# Altium project MSXV_PCS_Rev_1.2.PrjPcb
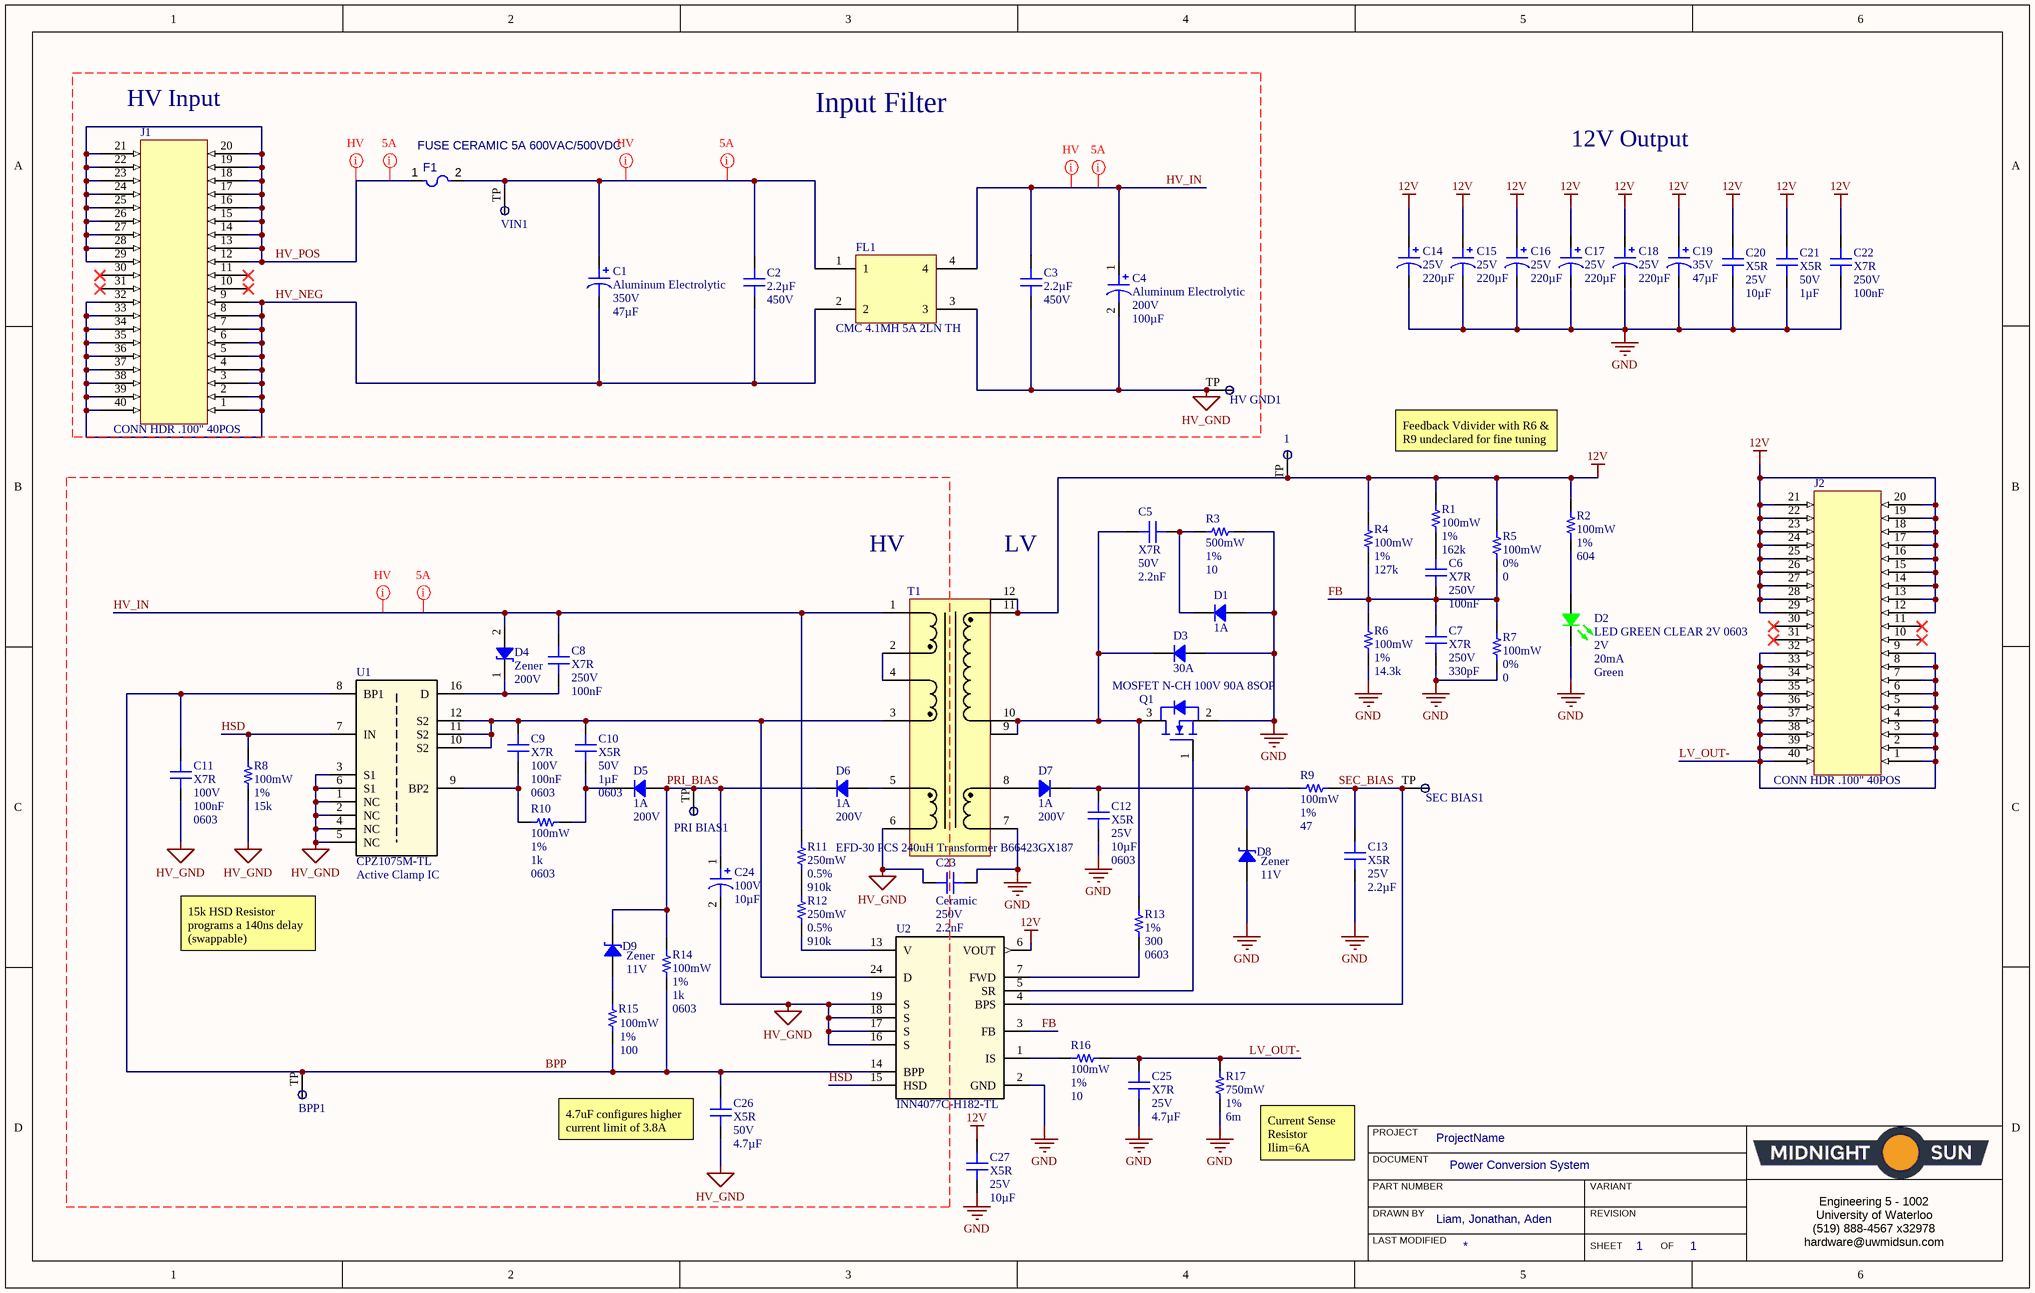
[diagram p0: PCS Schematic.SchDoc]
1 sheet, 67 parts. Net scope: global (net labels, ports and power ports of the same name join across sheets).
Board file: PCS - PCB.PcbDoc

## Sheet PCS Schematic.SchDoc: Power Conversion System
size B; Author: Liam Sky, Jonathan Xie, Aden Chu; Engineer: Liam Sky, Jonathan Xie, Aden Chu; Organization: Midnight Sun Solar Rayce Car Team; Address1: University of Waterloo; Address2: 200 University Ave W; Address3: Waterloo, ON, Canada; Address4: N2L 3E9; Revision: 1,0; SheetNumber: 1; SheetTotal: 1; Website: www.uwmidsun.com; ProjectAuthor: Liam, Jonathan, Aden; ProjectName: ProjectName

### Parts
1  Test Point SMD  [Test Point]  (value not drawn)  (no BOM)
BPP1  Test Point SMD  [Test Point]  (value not drawn)  (no BOM)
C1  Dielectric Code: Aluminum Electrolytic  Voltage Rating: 350V  Capacitance: 47µF  [Radial e7.5mm h27]  (hidden comment: CAP ALUM 47UF 20% 350V RADIAL TH)
C2  Capacitance: 2.2µF  Voltage Rating: 450V  [CAP FILM 2.2UF 5% 450VDC RADIAL-Footprint-1]  (hidden comment: CAP FILM 2.2UF 5% 450VDC RADIAL)
C3  Capacitance: 2.2µF  Voltage Rating: 450V  [CAP FILM 2.2UF 5% 450VDC RADIAL-Footprint-1]  (hidden comment: CAP FILM 2.2UF 5% 450VDC RADIAL)
C4  Dielectric Code: Aluminum Electrolytic  Voltage Rating: 200V  Capacitance: 100µF  [Radial e7.5mm h27]  (hidden comment: CAP ALUM 100UF 20% 200V RADIAL)
C5  Dielectric Code: X7R  Voltage Rating: 50V  Capacitance: 2.2nF  [CAP 0603_1608]  (hidden comment: CAP CER 2.2NF 50V 10% X7R 0603)
C6  Dielectric Code: X7R  Voltage Rating: 250V  Capacitance: 100nF  [FER 0805_2012]  (hidden comment: CAP CER 0.1UF 250V X7R 0805)
C7  Dielectric Code: X7R  Voltage Rating: 250V  Capacitance: 330pF  [CAP 0603_1608]  (hidden comment: CAP CER 330PF 250V X7R 0603)
C8  Dielectric Code: X7R  Voltage Rating: 250V  Capacitance: 100nF  [CAP 1206_3216]  (hidden comment: CAP CER 0.1UF 250V X7R 1206)
C9  Dielectric Code: X7R  Voltage Rating: 100V  Capacitance: 100nF  Case/Package: 0603  [CAP 0603_1608]  (hidden comment: CAP CER 0.1UF 100V 10% X7R 0603)
C10  Dielectric Code: X5R  Voltage Rating: 50V  Capacitance: 1µF  Case/Package: 0603  [CAP 0603_1608]  (hidden comment: CAP CER 1UF 50V X5R 0603)
C11  Dielectric Code: X7R  Voltage Rating: 100V  Capacitance: 100nF  Case/Package: 0603  [CAP 0603_1608]  (hidden comment: CAP CER 0.1UF 100V 10% X7R 0603)
C12  Dielectric Code: X5R  Voltage Rating: 25V  Capacitance: 10µF  Case/Package: 0603  [CAP 0603_1608]  (hidden comment: CAP CER 10UF 25V 20% X5R 0603)
C13  Dielectric Code: X5R  Voltage Rating: 25V  Capacitance: 2.2µF  [CAP 0603_1608]  (hidden comment: CAP CER 2.2UF 25V 10% X5R 0603)
C14  Voltage Rating: 25V  Capacitance: 220µF  [CAP ALUM 220UF 20% 25V RADIAL-Footprint-1]  (hidden comment: CAP ALUM 220UF 20% 25V RADIAL)
C15  Voltage Rating: 25V  Capacitance: 220µF  [CAP ALUM 220UF 20% 25V RADIAL-Footprint-1]  (hidden comment: CAP ALUM 220UF 20% 25V RADIAL)
C16  Voltage Rating: 25V  Capacitance: 220µF  [CAP ALUM 220UF 20% 25V RADIAL-Footprint-1]  (hidden comment: CAP ALUM 220UF 20% 25V RADIAL)
C17  Voltage Rating: 25V  Capacitance: 220µF  [CAP ALUM 220UF 20% 25V RADIAL-Footprint-1]  (hidden comment: CAP ALUM 220UF 20% 25V RADIAL)
C18  Voltage Rating: 25V  Capacitance: 220µF  [CAP ALUM 220UF 20% 25V RADIAL-Footprint-1]  (hidden comment: CAP ALUM 220UF 20% 25V RADIAL)
C19  Voltage Rating: 35V  Capacitance: 47µF  [CAP ALUM 6.3MM RADIAL SMD]  (hidden comment: CAP ALUM 47UF 20% 35V SMD)
C20  Dielectric Code: X5R  Voltage Rating: 25V  Capacitance: 10µF  [CAP 0603_1608]  (hidden comment: CAP CER 10UF 25V 20% X5R 0603)
C21  Dielectric Code: X5R  Voltage Rating: 50V  Capacitance: 1µF  [CAP 0603_1608]  (hidden comment: CAP CER 1UF 50V X5R 0603)
C22  Dielectric Code: X7R  Voltage Rating: 250V  Capacitance: 100nF  [FER 0805_2012]  (hidden comment: CAP CER 0.1UF 250V X7R 0805)
C23  Dielectric Code: Ceramic  Voltage Rating: 250V  Capacitance: 2.2nF  [FP-DE1_D9_T4_F10_d0_6-0_0-MFG]  (hidden comment: CAP CER 2200PF 250V RADIAL)
C24  Voltage Rating: 100V  Capacitance: 10µF  [FP-RAD-TH-D_5_0_5-L_11_1-MFG]  (hidden comment: CAP ALUM 10UF 20% 100V RADIAL TH)
C25  Dielectric Code: X7R  Voltage Rating: 25V  Capacitance: 4.7µF  [CAP 0603_1608]  (hidden comment: CAP CER 4.7UF 25V 10% X5R 0603)
C26  Dielectric Code: X5R  Voltage Rating: 50V  Capacitance: 4.7µF  [CAP 0805_2012]  (hidden comment: CAP CER 4.7UF 50V 10% X5R 0805)
C27  Dielectric Code: X5R  Voltage Rating: 25V  Capacitance: 10µF  [CAP 0603_1608]  (hidden comment: CAP CER 10UF 25V 20% X5R 0603)
D1  Forward Current: 1A  [DO 214AC SMA]  (hidden comment: ULTRA FAST RECOVERY RECTIFIERS 2)
D2  LED GREEN CLEAR 2V 0603  Forward Voltage: 2V  Forward Current: 20mA  Colour: Green  [LED 0603_1608]
D3  Forward Current: 30A  [New footprint 1]  (hidden comment: DIODE SCHOTTKY 170V 30A PWRFLAT)
D4  Type: Zener  Reverse Blocking Voltage: 200V  [DIODE ZENER 200V 800MW DO219AB-Footprint-1]  (hidden comment: DIODE ZENER 200V 800MW DO219AB)
D5  Forward Current: 1A  Reverse Blocking Voltage: 200V  [DO 214AC SMA]  (hidden comment: ULTRA FAST RECOVERY RECTIFIERS 2)
D6  Forward Current: 1A  Reverse Blocking Voltage: 200V  [DO 214AC SMA]  (hidden comment: ULTRA FAST RECOVERY RECTIFIERS 2)
D7  Forward Current: 1A  Reverse Blocking Voltage: 200V  [DO 214AC SMA]  (hidden comment: ULTRA FAST RECOVERY RECTIFIERS 2)
D8  Type: Zener  Reverse Blocking Voltage: 11V  [SOD 323]  (hidden comment: DIODE, ZENER, 0.20W, 11.0V, 2%,)
D9  Type: Zener  Reverse Blocking Voltage: 11V  [SOD 323]  (hidden comment: DIODE, ZENER, 0.20W, 11.0V, 2%,)
F1  FUSE CERAMIC 5A 600VAC/500VDC  [0ADKC5000-BE-Footprint-1]
FL1  CMC 4.1MH 5A 2LN TH  [New footprint 1]
HV_GND1  Test Point SMD  [Test Point]  (value not drawn)  (no BOM)
J1  CONN HDR .100" 40POS  [CONN HDR .100" 40POS-Footprint-1]
J2  CONN HDR .100" 40POS  [CONN HDR .100" 40POS-Footprint-1]
PRI_BIAS1  Test Point SMD  [Test Point]  (value not drawn)  (no BOM)
Q1  MOSFET N-CH 100V 90A 8SOP  [TPH3R70APL,L1Q]
R1  Power Rating: 100mW  Tolerance: 1%  Resistance: 162k  [RES 0603_1608]  (hidden comment: RES 162K OHM 1% 1/10W 0603)
R2  Power Rating: 100mW  Tolerance: 1%  Resistance: 604  [RES 0603_1608]  (hidden comment: RES 604 OHM 1% 1/10W 0603)
R3  Power Rating: 500mW  Tolerance: 1%  Resistance: 10  [CAP 0805_2012]  (hidden comment: RES 10 OHM 1% 1/2W 0805)
R4  Power Rating: 100mW  Tolerance: 1%  Resistance: 127k  [RES 0603_1608]  (hidden comment: RES 127K OHM 1% 1/10W 0603)
R5  Power Rating: 100mW  Tolerance: 0%  Resistance: 0  [RES 0603_1608]  (hidden comment: RES 0 OHM JUMPER 1/10W 0603)
R6  Power Rating: 100mW  Tolerance: 1%  Resistance: 14.3k  [RES 0603_1608]  (hidden comment: RES 14.3K OHM 1% 1/10W 0603)
R7  Power Rating: 100mW  Tolerance: 0%  Resistance: 0  [RES 0603_1608]  (hidden comment: RES 0 OHM JUMPER 1/10W 0603)
R8  Power Rating: 100mW  Tolerance: 1%  Resistance: 15k  [RES 0603_1608]  (hidden comment: RES 15K OHM 1% 1/10W 0603)
R9  Power Rating: 100mW  Tolerance: 1%  Resistance: 47  [RES 0603_1608]  (hidden comment: RES 47 OHM 1% 1/10W 0603)
R10  Power Rating: 100mW  Tolerance: 1%  Resistance: 1k  Case/Package: 0603  [RES 0603_1608]  (hidden comment: RES 1K OHM 1% 1/10W 0603)
R11  Power Rating: 250mW  Tolerance: 0.5%  Resistance: 910k  [RES 0805_2012]  (hidden comment: RES SMD 910K OHM 0.5% 1/4W 0805)
R12  Power Rating: 250mW  Tolerance: 0.5%  Resistance: 910k  [RES 0805_2012]  (hidden comment: RES SMD 910K OHM 0.5% 1/4W 0805)
R13  Tolerance: 1%  Resistance: 300  Case/Package: 0603  [RES 0603_1608]  (hidden comment: RES 300 OHM 1% 1/10W 0603)
R14  Power Rating: 100mW  Tolerance: 1%  Resistance: 1k  Case/Package: 0603  [RES 0603_1608]  (hidden comment: RES 1K OHM 1% 1/10W 0603)
R15  Power Rating: 100mW  Tolerance: 1%  Resistance: 100  [RES 0603_1608]  (hidden comment: RES 100 OHM 1% 1/10W 0603)
R16  Power Rating: 100mW  Tolerance: 1%  Resistance: 10  [RES 0603_1608]  (hidden comment: RES 10 OHM 1% 1/10W 0603)
R17  Power Rating: 750mW  Tolerance: 1%  Resistance: 6m  [RES 0805_2012]  (hidden comment: RES 0.006 OHM 1% 3/4W 0805)
SEC_BIAS1  Test Point SMD  [Test Point]  (value not drawn)  (no BOM)
T1  EFD-30 PCS 240uH Transformer B66423GX187  [EFD-30 PCS 240uH Transformer B66423GX187-Footprint-1]
U1  CPZ1075M-TL  [CPZ1076M-Footprint-1]
U2  INN4077C-H182-TL  [INN4074C-H185-Footprint-1]
VIN1  Test Point SMD  [Test Point]  (value not drawn)  (no BOM)

### Nets
12V: 1.TP C14.1 C15.1 C16.1 C17.1 C18.1 C19.1 C20.2 C21.2 C22.2 C27.2 J2.12 J2.13 J2.14 J2.15 J2.16 J2.17 J2.18 J2.19 J2.20 J2.21 J2.22 J2.23 J2.24 J2.25 J2.26 J2.27 J2.28 J2.29 R1.2 R2.2 R4.2 R5.1 T1.11(Sec+) T1.12(Sec+) U2.6(VOUT)
GND: C7.2 C12.2 C13.2 C14.2 C15.2 C16.2 C17.2 C18.2 C19.2 C20.1 C21.1 C22.1 C23.2 C25.1 C27.1 D1.2 D2.1 D3.1(A) D8.2 Q1.2(S) R3.2 R6.1 R7.1 R17.2 T1.7(Bias2-) U2.2(GND)
HV_GND: C3.1 C4.2 C11.1 C23.1 C24.2 C26.1 FL1.3 HV_GND1.TP R8.1 T1.6(Bias1-) U1.1(NC) U1.2(NC) U1.3(S1) U1.4(NC) U1.5(NC) U1.6(S1) U2.16(S) U2.17(S) U2.18(S) U2.19(S)
BPP: BPP1.TP C11.2 C26.2 R14.1 R15.1 U1.8(BP1) U2.14(BPP)
FB: C6.1 C7.1 R4.1 R5.2 R6.2 R7.2 U2.3(FB)
HSD: R8.2 U1.7(IN) U2.15(HSD)
HV_IN: C3.2 C4.1 C8.2 D4.2 FL1.4 R11.1 T1.1(Pri+)
HV_NEG: C1.2 C2.1 FL1.2 J1.1 J1.2 J1.3 J1.4 J1.5 J1.6 J1.7 J1.8 J1.9 J1.32 J1.33 J1.34 J1.35 J1.36 J1.37 J1.38 J1.39 J1.40
HV_POS: F1.1 J1.12 J1.13 J1.14 J1.15 J1.16 J1.17 J1.18 J1.19 J1.20 J1.21 J1.22 J1.23 J1.24 J1.25 J1.26 J1.27 J1.28 J1.29
LV_OUT-: C25.2 J2.1 J2.2 J2.3 J2.4 J2.5 J2.6 J2.7 J2.8 J2.9 J2.32 J2.33 J2.34 J2.35 J2.36 J2.37 J2.38 J2.39 J2.40 R16.1 R17.1
PRI_BIAS: C24.1 D5.2 D6.1 D9.1 PRI_BIAS1.TP R14.2
SEC_BIAS: C13.1 R9.1 SEC_BIAS1.TP U2.4(BPS)
NetC1_1: C1.1 C2.2 F1.2 FL1.1 VIN1.TP
NetC5_1: C5.1 D3.2(K) Q1.3(D) R13.2 T1.9(Sec-) T1.10(Sec-)
NetC5_2: C5.2 D1.1 R3.1
NetC6_2: C6.2 R1.1
NetC8_1: C8.1 D4.1 U1.16(D)
NetC9_1: C9.1 R10.2 U1.9(BP2)
NetC9_2: C9.2 C10.2 T1.3(Pri-) U1.10(S2) U1.11(S2) U1.12(S2) U2.24(D)
NetC10_1: C10.1 D5.1 R10.1
NetC12_1: C12.1 D7.1 D8.1 R9.2
NetD2_2: D2.2 R2.1
NetD6_2: D6.2 T1.5(Bias1+)
NetD7_2: D7.2 T1.8(Bias2+)
NetD9_2: D9.2 R15.2
NetQ1_1: Q1.1(G) U2.5(SR)
NetR11_2: R11.2 R12.1
NetR12_2: R12.2 U2.13(V)
NetR13_1: R13.1 U2.7(FWD)
NetR16_2: R16.2 U2.1(IS)
NetT1_2: T1.2(Pri+) T1.4(Pri-)

Not connected (* = marked no-connect by the designer): J1 10* 11* 30* 31*; J2 10* 11* 30* 31*; U2 8(NC) 9(NC) 10(NC) 11(NC) 12(NC)

### Layout directives
mark named HV: HV_IN
net class HV: HV_IN, HV_POS, NetC1_1
net class 5A: HV_IN, HV_POS, NetC1_1

### Notes on the sheet
- (near J1) HV Input
- Input Filter
- 12V Output
- Feedback Vdivider with R6 & R9 undeclared for fine tuning
- (near T1) HV
- (near T1) LV
- (near U1) Active Clamp IC
- 15k HSD Resistor programs a 140ns delay (swappable)
- (near C26) 4.7uF configures higher current limit of 3.8A
- (near R17) Current Sense Resistor Ilim=6A
- PROJECT
- DOCUMENT
- DRAWN BY
- LAST MODIFIED
- PART NUMBER
- REVISION
- SHEET
- VARIANT
- OF
- Engineering 5 - 1002
  University of Waterloo
  (519) 888-4567 x32978
  hardware@uwmidsun.com

### Library data of the parts
1 BPP1 HV_GND1 PRI_BIAS1 SEC_BIAS1 VIN1 = CMP-004-0000-4: 1.27mm x 1.27mm SMD Square
C1 = CMP-001-00158-1: 47 µF 350 V Aluminum Electrolytic Capacitors Radial, Can 2000 Hrs @ 105°C; Case/Package: Radial; Tolerance: 20%
C2 C3 = CMP-001-00150-1: 2.2 µF Film Capacitor 450V Polypropylene (PP), Metallized Radial; Case/Package: 7450; Tolerance: 5%
C4 = CMP-001-00159-3: 100 µF 200 V Aluminum Electrolytic Capacitors Radial, Can 2000 Hrs @ 105°C; Case/Package: Radial; Tolerance: 20%
C5 = CMP-001-00089-6: ±10% 50V Ceramic Capacitor X7R 0603 (1608 Metric); Case/Package: 0603; Tolerance: 10%
C6 C22 = CMP-001-00145-1: Ceramic Capacitor, Multilayer, Ceramic, 250V, 10% +Tol, 10% -Tol, X7R, 15% TC, 0.1uF, Surface Mount, 0805; Case/Package: 0805; Tolerance: 10%
C7 = CMP-001-00020-1: 330 pF ±10% 250V Ceramic Capacitor X7R 0603 (1608 Metric); Tolerance: 10%; Case/Package: 0603
C8 = CMP-001-00147-1: 0.1 µF ±10% 250V Ceramic Capacitor X7R 1206 (3216 Metric); Tolerance: 10%; Case/Package: 1206
C9 C11 = CMP-013-0022-14: Ceramic Capacitor, Multilayer, Ceramic, 100V, 10% +Tol, 10% -Tol, X7R, 15% TC, 0.1uF, Surface Mount, 0603; Tolerance: 10%
C10 C21 = CMP-013-0013-8: 1µF ±10% 50V Ceramic Capacitor X7R 0603 (1608 Metric); Tolerance: 10%
  C21: Case/Package: 0603
C12 C20 C27 = CMP-013-0018-6: 10µF ±20% 25V Ceramic Capacitor X5R 0603 (1608 Metric); Tolerance: 20%
  C20 C27: Case/Package: 0603
C13 = CMP-013-0100-6: 2.2µF ±10% 25V Ceramic Capacitor X5R 0603 (1608 Metric); Tolerance: 10%; Case/Package: 0603
C14-C18 = CMP-001-00144-1: 220 µF 25 V Aluminum Electrolytic Capacitors Radial, Can 2000 Hrs @ 85°C; Tolerance: 20%; Case/Package: SMT
C19 = CMP-013-0000-4: 47µF 35V Aluminum Electrolytic Capacitors Radial, Can - SMD 1000 Hrs @ 85°C; Case/Package: Radial; Tolerance: 20%
C23 = CMP-001-00157-1: 2200 pF ±20% 250VAC Ceramic Capacitor E Radial, Disc; Tolerance: 20%; Case/Package: Radial
C24 = CMP-001-00029-3: 10 µF 100 V Aluminum Electrolytic Capacitors Radial, Can 2000 Hrs @ 85°C; Tolerance: 20%; Case/Package: Radial
C25 = CMP-013-0104-5: 4.7µF ±10% 25V Ceramic Capacitor X5R 0603 (1608 Metric); Case/Package: 0603; Tolerance: 10%
C26 = CMP-013-0066-5: 4.7µF ±20% 50V Ceramic Capacitor X5R 0805 (2012 Metric); Tolerance: 20%; Case/Package: 0805
D1 = CMP-004-00072-2: Diode 200 V 1A Surface Mount SMA/DO-214AC; Reverse Blocking Voltage: 200V; Forward Voltage: 1V; Case/Package: DO-214AC-SMA
D2 = CMP-011-0001-9: Green 562nm LED Indication - Discrete 2V 0603 (1608 Metric); Case/Package: 0603 (1608 Metric)
D3 = CMP-004-00074-2: Diode 170 V 30A Surface Mount PowerFlat™ (5x6); Number of Phases: 1; Qualification Status: Not Qualified; Forward Voltage: 700mV; Application(s): FAST RECOVERY POWER; Diode Element Material: SILICON; Package Body Material: Plastic; Case Connection: CATHODE; Additional Feature: FREE WHEELING DIODE; Diode Type: RECTIFIER; Non-rep Pk Forward Current-Max: 200A; Reverse Blocking Voltage: 170V; Case/Package: 8-PowerVDFN; Surface Mount: Yes; Max Operating Temperature: 175°C; Terminal Form: No Lead; Moisture Sensitivity Level: 1; Package Shape: Rectangular; Rep Pk Reverse Voltage-Max: 170V; Pins: 3; Number of Elements: 1; Max Output current: 30A; Reach SVHC Compliant: No; RoHS Compliant: Yes; Package Style: SMALL OUTLINEMeter; JESD-609 Code: e3; Technology: SCHOTTKY; Terminal Finish: Tin; Peak Reflow Temperature (Cel): 260°C; Terminal Position: DUAL
D4 = CMP-004-00005-2: Zener Diode 200 V 800 mW Surface Mount DO-219AB (SMF); Case/Package: DO-219AB; Breakdown Voltage: 200V
D5-D7 = CMP-004-00072-2: Diode 200 V 1A Surface Mount SMA/DO-214AC; Forward Voltage: 1V; Case/Package: DO-214AC-SMA
D8 D9 = CMP-004-00076-1: Zener Diode 11 V 200 mW ±2% Surface Mount SOD-323; Case/Package: SOD 323; Breakdown Voltage: 11V
F1 = CMP-005-00013-1: FUSE CERAMIC 5A 600VAC/500VDC FOOTPRINT IS FOR 5x20mm HOLDER; Fuse Type: Cartridge, Ceramic; Approvals: cURus; Voltage Rating (DC): 500V; Voltage Rating (AC): 600V; Mount: Holder; Current Rating: 5A; Min Operating Temperature: -55°C; Max Operating Temperature: 125°C; Packaging: Bulk
FL1 = CMP-00030-00009-2: 4.1 mH @ 10 kHz 2 Line Common Mode Choke Through Hole 5A DCR 35mOhm; Inductance @10KHz: 4.1mH; Case/Package: 4 Pin; Max Current: 5A
J1 J2 = CMP-002-00024-2: Board Connector, 40 Contact(s), 2 Row(s), Male, Straight, Solder Terminal; Max Operating Temperature: 125°C; Min Operating Temperature: -55°C; RoHS Compliant: Yes; Connector Type: BOARD CONNECTOR; Mounting Technology: Board; Gender: Male; Pins: 40
Q1 = CMP-013-00052-4: N-Channel 100 V 90A (Tc) 960mW (Ta), 170W (Tc) Surface Mount 8-SOP Advance (5x5); Vgs (Max): 20V; Vgs(th) (Max) @ Id: 2.5V @ 1mA; Power: 170W; Drain to Source Voltage (Vdss): 100V; Case/Package: 8-SOP Advance (5x5)
R1 = CMP-00036-1: Fixed Resistor, Metal Glaze/thick Film, 0.1W, 162000ohm, 75V, 1% +/-Tol, 100ppm/Cel, Surface Mount, 0603; Temperature Coefficient: 100ppm/°C; Case/Package: 0603; Voltage Rating: 75V
R2 = CMP-00038-1: Fixed Resistor, Metal Glaze/thick Film, 0.1W, 604ohm, 75V, 1% +/-Tol, 100ppm/Cel, Surface Mount, 0603; Temperature Coefficient: 100ppm/°C; Case/Package: 0603; Voltage Rating: 75V
R3 = CMP-00047-4: 10 Ohms ±1% 0.5W, 1/2W Chip Resistor 0805 (2012 Metric) Automotive AEC-Q200, Pulse Withstanding Thick Film; Temperature Coefficient: 200ppm/°C; Voltage Rating: 400V; Case/Package: 0805
R4 = CMP-00028-1: Fixed Resistor, Metal Glaze/thick Film, 0.1W, 127000ohm, 75V, 1% +/-Tol, 100ppm/Cel, Surface Mount, 0603; Temperature Coefficient: 100ppm/°C; Voltage Rating: 75V; Case/Package: 0603
R5 R7 = CMP-010-0000-7: Fixed Resistor, Metal Glaze/thick Film, 0.1W, 0ohm, Surface Mount, 0603; Voltage Rating: 75V; Temperature Coefficient: 0ppm/°C; Case/Package: 0603
R6 = CMP-00053-1: 14.3 kOhms ±1% 0.1W, 1/10W Chip Resistor 0603 (1608 Metric) Automotive AEC-Q200 Thick Film; Voltage Rating: 200V; Temperature Coefficient: 100; Case/Package: 0603
R8 = CMP-010-0035-11: 15 kOhms ±1% 0.1W, 1/10W Chip Resistor 0603 (1608 Metric) Moisture Resistant Thick Film; Temperature Coefficient: 100ppm/°C; Voltage Rating: 75V; Case/Package: 0603
R9 = CMP-009-00196-9: Fixed Resistor, Metal Glaze/thick Film, 0.1W, 47ohm, 75V, 1% +/-Tol, 100ppm/Cel, Surface Mount, 0603; Temperature Coefficient: 100ppm/°C; Case/Package: 0603; Voltage Rating: 75V
R10 R14 = CMP-009-00014-17: 1 kOhms ±1% 0.1W, 1/10W Chip Resistor 0603 (1608 Metric) Moisture Resistant Thick Film; Temperature Coefficient: 100ppm/°C; Voltage Rating: 75V
R11 R12 = CMP-00148-1: 910 kOhms ±0.5% 0.25W, 1/4W Chip Resistor 0805 (2012 Metric) Automotive AEC-Q200 Thick Film; Temperature Coefficient: 50; Voltage Rating: 476V; Case/Package: 0805
R13 = CMP-00045-2: 300 Ohms ±1% 0.1W, 1/10W Chip Resistor 0603 (1608 Metric) Automotive AEC-Q200 Thick Film; Power Rating: 100mW; Voltage Rating: 75V; Temperature Coefficient: 100ppm/°C
R15 = CMP-009-00178-14: 100 Ohms ±1% 0.1W, 1/10W Chip Resistor 0603 (1608 Metric) Moisture Resistant Thick Film; Temperature Coefficient: 100ppm/°C; Voltage Rating: 75V; Case/Package: 0603
R16 = CMP-00047-2: Fixed Resistor, Metal Glaze/thick Film, 0.1W, 10ohm, 75V, 1% +/-Tol, 100ppm/Cel, Surface Mount, 0603; Temperature Coefficient: 100ppm/°C; Voltage Rating: 75V; Case/Package: 0603
R17 = CMP-00031-1: Res 0805 50PPM 0.006 Ohm 1.0%; Temperature Coefficient: ±50ppm/°C; Voltage Rating: 100V; Case/Package: 0805
T1 = CMP-012-00025-15: EFD30/15/9-N87
U1 = CMP-031-00055-7: Converter Offline Flyback, Secondary Side SR Topology 102kHz MinSOP-16A; Min Supply Voltage: 265V; Max Supply Voltage: 85V; Manufacturer Part Number: CPZ1075M-TL; Case/Package: InSOP16
U2 = CMP-031-00054-7: ZVS Flyback Switcher/Controller IC InSOP-24D 135W; Manufacturer Part Number: INN4074C-H185; Min Supply Voltage: 264V; Max Supply Voltage: 85V; Case/Package: InSOP-24D